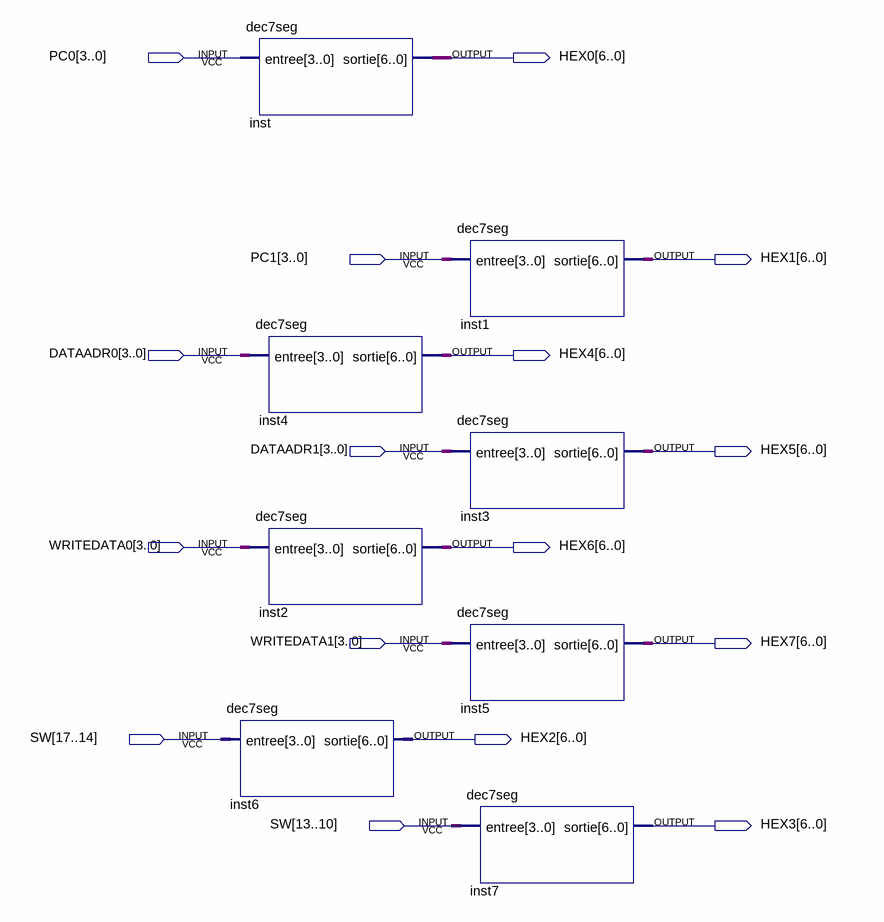
[diagram p0: schematic sheet]
// Quartus schematic affichage.bdf as structural Verilog: 8 symbols, 16 pins
module affichage (
  input  [3:0] PC0,
  input  [3:0] PC1,
  input  [3:0] DATAADR0,
  input  [3:0] DATAADR1,
  input  [3:0] WRITEDATA0,
  input  [3:0] WRITEDATA1,
  input  [17:10] SW,
  output [6:0] HEX0,
  output [6:0] HEX1,
  output [6:0] HEX4,
  output [6:0] HEX5,
  output [6:0] HEX6,
  output [6:0] HEX7,
  output [6:0] HEX2,
  output [6:0] HEX3
);

  dec7seg inst (.entree(PC0), .sortie(HEX0));
  dec7seg inst4 (.entree(DATAADR0), .sortie(HEX4));
  dec7seg inst2 (.entree(WRITEDATA0), .sortie(HEX6));
  dec7seg inst6 (.entree(SW[17:14]), .sortie(HEX2));
  dec7seg inst1 (.entree(PC1), .sortie(HEX1));
  dec7seg inst3 (.entree(DATAADR1), .sortie(HEX5));
  dec7seg inst5 (.entree(WRITEDATA1), .sortie(HEX7));
  dec7seg inst7 (.entree(SW[13:10]), .sortie(HEX3));
endmodule
